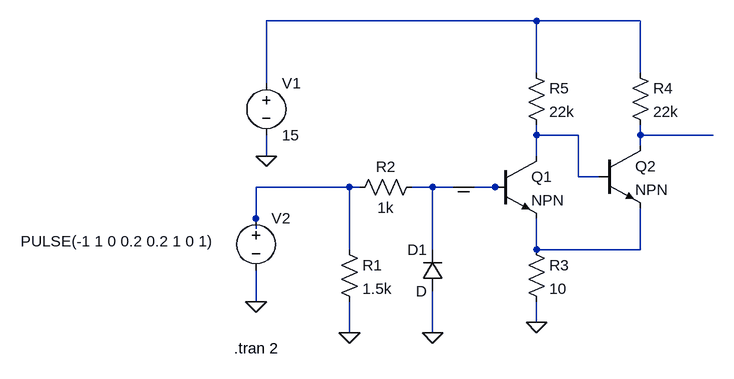
[diagram p0: schematic main.asc]
main.asc, the LTspice schematic file:
Version 4
SHEET 1 880 680
WIRE -288 -64 -704 -64
WIRE -128 -64 -288 -64
WIRE -288 16 -288 -64
WIRE -128 16 -128 -64
WIRE -704 32 -704 -64
WIRE -288 112 -288 96
WIRE -224 112 -288 112
WIRE -128 112 -128 96
WIRE -16 112 -128 112
WIRE -128 128 -128 112
WIRE -704 144 -704 112
WIRE -288 144 -288 112
WIRE -224 176 -224 112
WIRE -192 176 -224 176
WIRE -576 192 -720 192
WIRE -560 192 -576 192
WIRE -448 192 -480 192
WIRE -400 192 -448 192
WIRE -352 192 -400 192
WIRE -336 192 -352 192
WIRE -720 240 -720 192
WIRE -720 256 -720 240
WIRE -576 288 -576 192
WIRE -448 288 -448 192
WIRE -288 288 -288 240
WIRE -128 288 -128 224
WIRE -128 288 -288 288
WIRE -720 368 -720 320
WIRE -288 400 -288 368
WIRE -576 416 -576 368
WIRE -448 416 -448 352
FLAG -448 416 0
FLAG -576 416 0
FLAG -288 400 0
FLAG -704 144 0
FLAG -720 368 0
FLAG -400 192 COM
SYMBOL npn -352 144 R0
SYMATTR InstName Q1
SYMBOL npn -192 128 R0
SYMATTR InstName Q2
SYMBOL diode -432 352 R180
WINDOW 0 24 64 Left 2
WINDOW 3 24 0 Left 2
SYMATTR InstName D1
SYMBOL res -592 272 R0
SYMATTR InstName R1
SYMATTR Value 1.5k
SYMBOL res -464 176 R90
WINDOW 0 0 56 VBottom 2
WINDOW 3 32 56 VTop 2
SYMATTR InstName R2
SYMATTR Value 1k
SYMBOL res -304 272 R0
SYMATTR InstName R3
SYMATTR Value 10
SYMBOL res -144 0 R0
SYMATTR InstName R4
SYMATTR Value 22k
SYMBOL res -304 0 R0
SYMATTR InstName R5
SYMATTR Value 22k
SYMBOL voltage -704 16 R0
WINDOW 123 0 0 Left 0
WINDOW 39 0 0 Left 0
SYMATTR InstName V1
SYMATTR Value 15
SYMBOL voltage -720 224 R0
WINDOW 3 -362 51 Left 2
WINDOW 123 0 0 Left 0
WINDOW 39 0 0 Left 0
SYMATTR InstName V2
SYMATTR Value PULSE(-1 1 0 0.2 0.2 1 0 1)
TEXT -754 440 Left 2 !.tran 2

The netlist it stands for:
* main.asc
Q1 N002 COM N005 0 NPN
Q2 N003 N002 N005 0 NPN
D1 0 COM D
R1 N004 0 1.5k
R2 COM N004 1k
R3 N005 0 10
R4 N001 N003 22k
R5 N001 N002 22k
V1 N001 0 15
V2 N004 0 PULSE(-1 1 0 0.2 0.2 1 0 1)
.model D D
.lib standard.dio
.model NPN NPN
.model PNP PNP
.lib standard.bjt
.tran 2
.backanno
.end